# Altium schematic sheet Power ATX.SchDoc
size A3; SheetNumber: 2; SheetTotal: 16
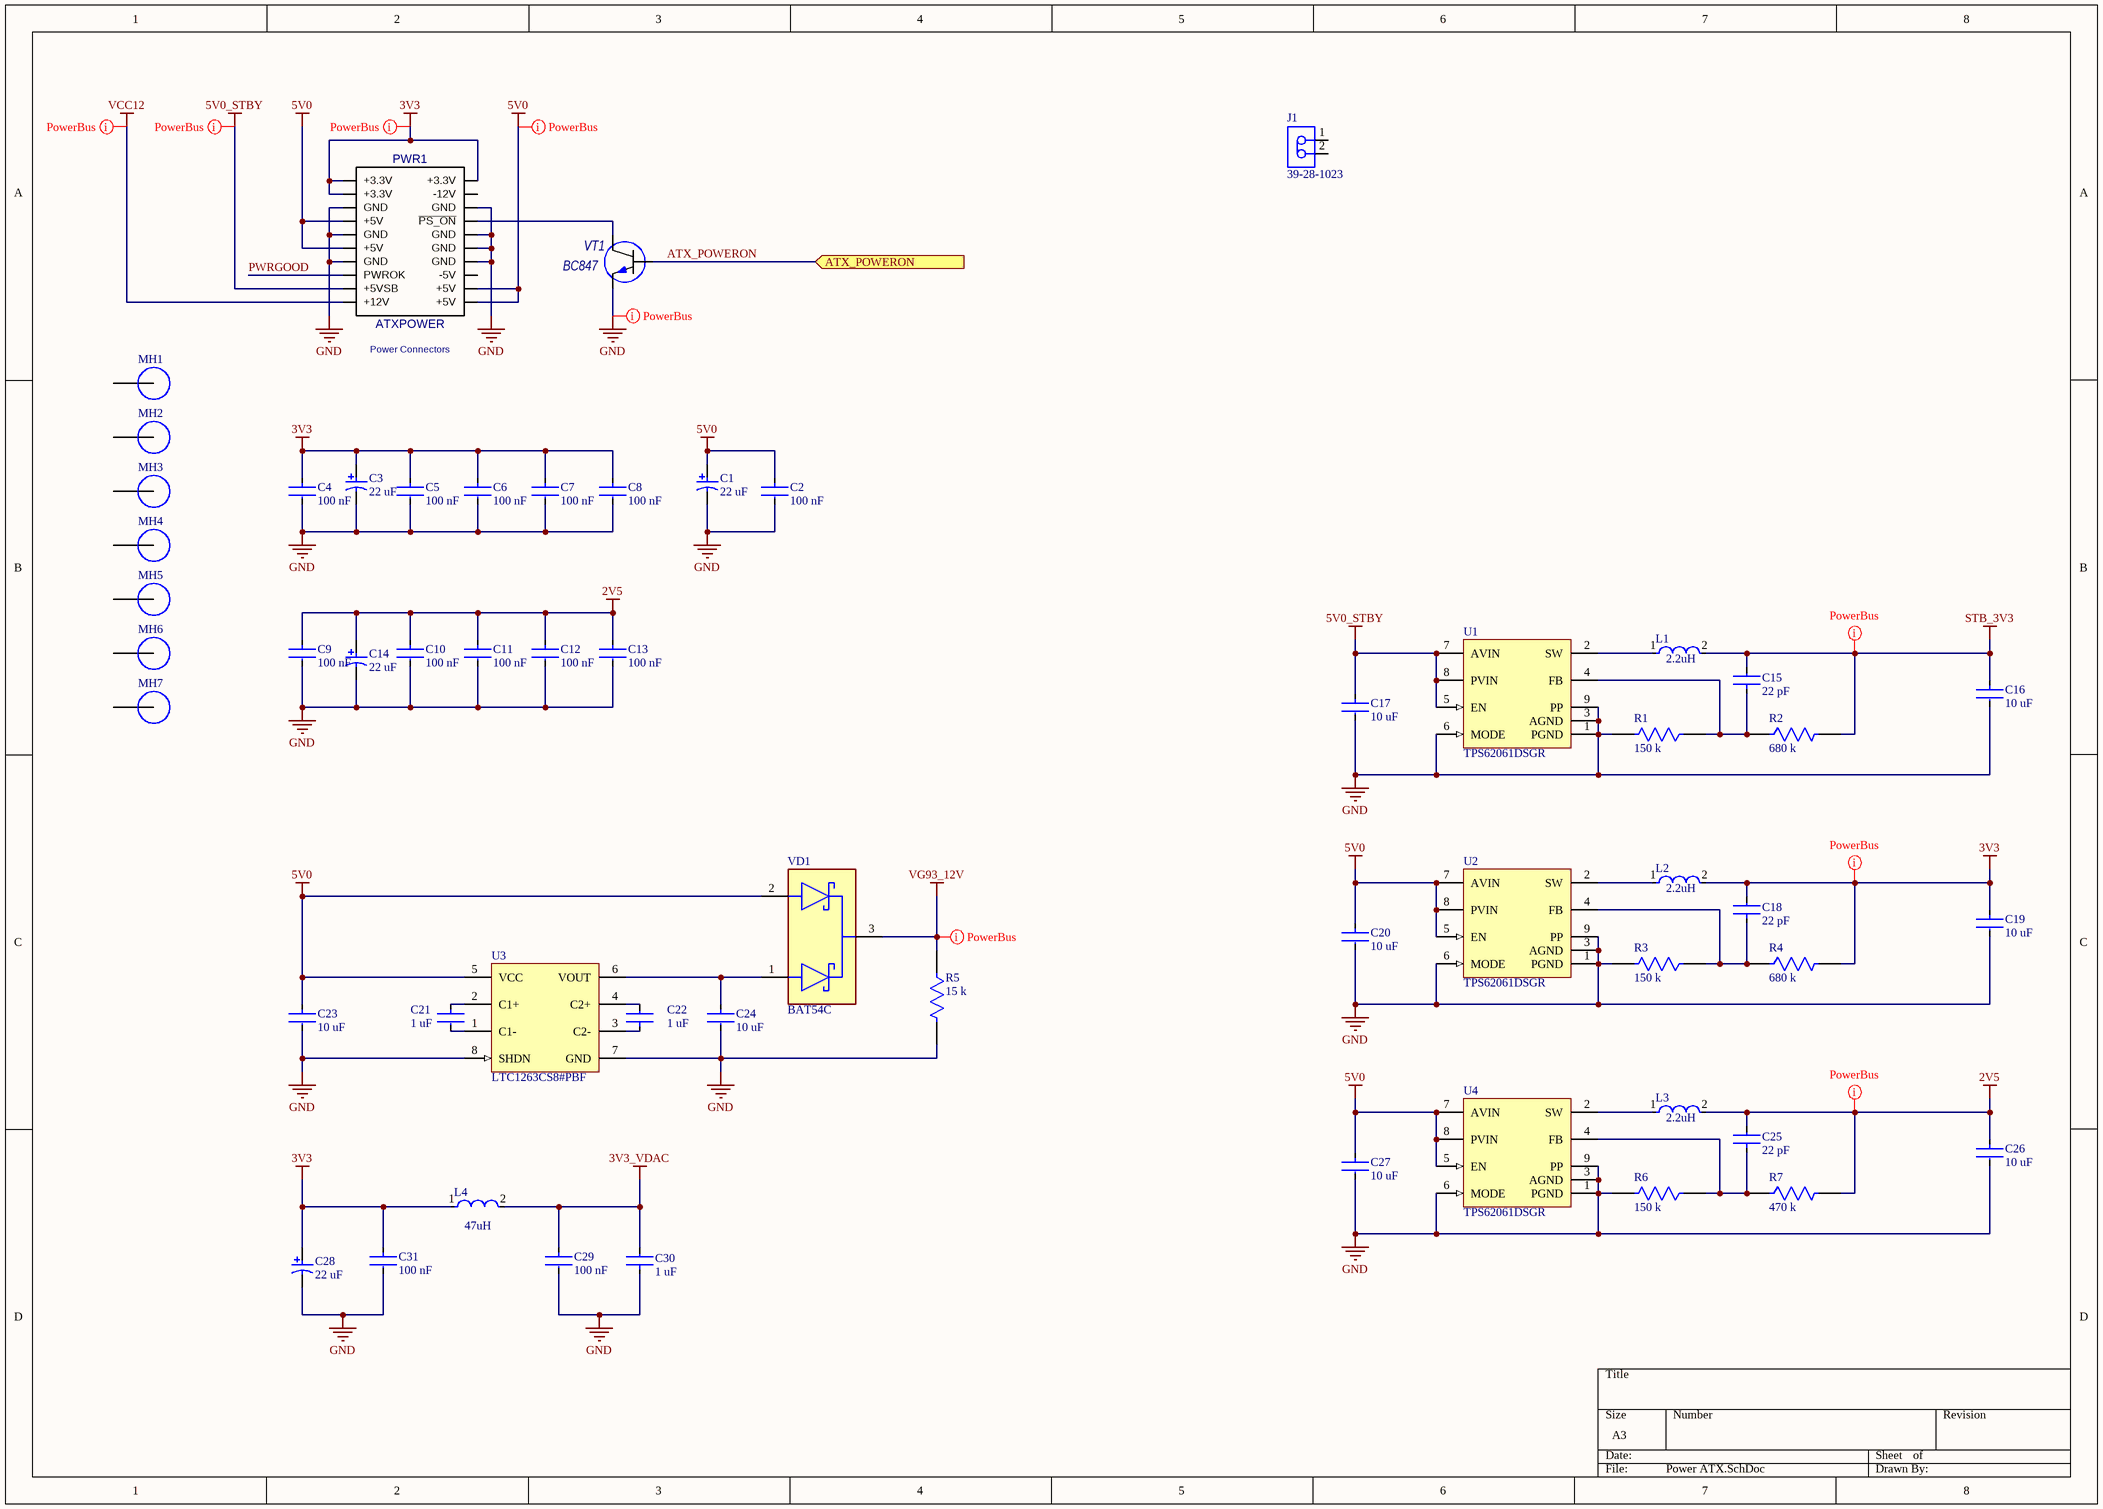
[diagram p0: Power ATX.SchDoc]

## Parts
C1  Capacitance: 22 uF  [AVX-TAJ-B-2_M]  (hidden comment: EC1210-22uF)
C2  Capacitance: 100 nF  [CC0805]  (hidden comment: CC0805-1.5pF)
C3  Capacitance: 22 uF  [AVX-TAJ-B-2_M]  (hidden comment: EC1210-22uF)
C4  Capacitance: 100 nF  [CC0805]  (hidden comment: CC0805-1.5pF)
C5  Capacitance: 100 nF  [CC0805]  (hidden comment: CC0805-1.5pF)
C6  Capacitance: 100 nF  [CC0805]  (hidden comment: CC0805-1.5pF)
C7  Capacitance: 100 nF  [CC0805]  (hidden comment: CC0805-1.5pF)
C8  Capacitance: 100 nF  [CC0805]  (hidden comment: CC0805-1.5pF)
C9  Capacitance: 100 nF  [CC0805]  (hidden comment: CC0805-1.5pF)
C10  Capacitance: 100 nF  [CC0805]  (hidden comment: CC0805-1.5pF)
C11  Capacitance: 100 nF  [CC0805]  (hidden comment: CC0805-1.5pF)
C12  Capacitance: 100 nF  [CC0805]  (hidden comment: CC0805-1.5pF)
C13  Capacitance: 100 nF  [CC0805]  (hidden comment: CC0805-1.5pF)
C14  Capacitance: 22 uF  [AVX-TAJ-B-2_M]  (hidden comment: EC1210-22uF)
C15  Capacitance: 22 pF  [CC0805]  (hidden comment: CC0805-1.5pF)
C16  Capacitance: 10 uF  [CC0805]  (hidden comment: CC0805-1.5pF)
C17  Capacitance: 10 uF  [CC0805]  (hidden comment: CC0805-1.5pF)
C18  Capacitance: 22 pF  [CC0805]  (hidden comment: CC0805-1.5pF)
C19  Capacitance: 10 uF  [CC0805]  (hidden comment: CC0805-1.5pF)
C20  Capacitance: 10 uF  [CC0805]  (hidden comment: CC0805-1.5pF)
C21  Capacitance: 1 uF  [CC0805]  (hidden comment: CC0805-1.5pF)
C22  Capacitance: 1 uF  [CC0805]  (hidden comment: CC0805-1.5pF)
C23  Capacitance: 10 uF  [CC0805]  (hidden comment: CC0805-1.5pF)
C24  Capacitance: 10 uF  [CC0805]  (hidden comment: CC0805-1.5pF)
C25  Capacitance: 22 pF  [CC0805]  (hidden comment: CC0805-1.5pF)
C26  Capacitance: 10 uF  [CC0805]  (hidden comment: CC0805-1.5pF)
C27  Capacitance: 10 uF  [CC0805]  (hidden comment: CC0805-1.5pF)
C28  Capacitance: 22 uF  [AVX-TAJ-B-2_M]  (hidden comment: EC1210-22uF)
C29  Capacitance: 100 nF  [CC0805]  (hidden comment: CC0805-1.5pF)
C30  Capacitance: 1 uF  [CC0805]  (hidden comment: CC0805-1.5pF)
C31  Capacitance: 100 nF  [CC0805]  (hidden comment: CC0805-1.5pF)
J1  39-28-1023  [MOLX-39-28-1023-2_V]
L1  Inductance: 2.2uH  [FP-NR6028-MFG]  (hidden comment: NR6028T2R2N)
L2  Inductance: 2.2uH  [FP-NR6028-MFG]  (hidden comment: NR6028T2R2N)
L3  Inductance: 2.2uH  [FP-NR6028-MFG]  (hidden comment: NR6028T2R2N)
L4  Inductance: 47uH  [FP-NR6028-MFG]  (hidden comment: NR6028T470M)
MH1  MOUNT HOLE  [MOUNT HOLE]  (value not drawn)
MH2  MOUNT HOLE  [MOUNT HOLE]  (value not drawn)
MH3  MOUNT HOLE  [MOUNT HOLE]  (value not drawn)
MH4  MOUNT HOLE  [MOUNT HOLE]  (value not drawn)
MH5  MOUNT HOLE  [MOUNT HOLE]  (value not drawn)
MH6  MOUNT HOLE  [MOUNT HOLE]  (value not drawn)
MH7  MOUNT HOLE  [MOUNT HOLE]  (value not drawn)
PWR1  ATXPOWER  [ATXPOWER]
R1  Resistance: 150 k  [CR0805]  (hidden comment: CR0805-51)
R2  Resistance: 680 k  [CR0805]  (hidden comment: CR0805-51)
R3  Resistance: 150 k  [CR0805]  (hidden comment: CR0805-51)
R4  Resistance: 680 k  [CR0805]  (hidden comment: CR0805-51)
R5  Resistance: 15 k  [CR0805]  (hidden comment: CR0805-51)
R6  Resistance: 150 k  [CR0805]  (hidden comment: CR0805-51)
R7  Resistance: 470 k  [CR0805]  (hidden comment: CR0805-51)
U1  TPS62061DSGR  [DSG0008A_V]
U2  TPS62061DSGR  [DSG0008A_V]
U3  LTC1263CS8#PBF  [LT-S8-8_N]
U4  TPS62061DSGR  [DSG0008A_V]
VD1  BAT54C  [SOT-23]
VT1  BC847  [SOT-23]

## Ports
ATX_POWERON (in)

## Nets
2V5: C9.1 C10.1 C11.1 C12.1 C13.1 C14.1 C25.2 C26.1 L3.2 R7.2
3V3: C3.1 C4.1 C5.1 C6.1 C7.1 C8.1 C18.2 C19.1 C28.1 C31.1 L2.2 L4.1 PWR1.1(+3.3V) PWR1.2(+3.3V) PWR1.11(+3.3V) R4.2
3V3_VDAC: C29.1 C30.2 L4.2
5V0: C1.1 C2.1 C20.1 C23.1 C27.1 PWR1.4(+5V) PWR1.6(+5V) PWR1.19(+5V) PWR1.20(+5V) U2.5(EN) U2.7(AVIN) U2.8(PVIN) U3.5(VCC) U4.5(EN) U4.7(AVIN) U4.8(PVIN) VD1.2(2_ANODE)
5V0_STBY: C17.1 PWR1.9(+5VSB) U1.5(EN) U1.7(AVIN) U1.8(PVIN)
GND: C1.2 C2.2 C3.2 C4.2 C5.2 C6.2 C7.2 C8.2 C9.2 C10.2 C11.2 C12.2 C13.2 C14.2 C16.2 C17.2 C19.2 C20.2 C23.2 C24.2 C26.2 C27.2 C28.2 C29.2 C30.1 C31.2 PWR1.3(GND) PWR1.5(GND) PWR1.7(GND) PWR1.13(GND) PWR1.15(GND) PWR1.16(GND) PWR1.17(GND) R1.2 R3.2 R5.2 R6.2 U1.1(PGND) U1.3(AGND) U1.6(MODE) U1.9(PP) U2.1(PGND) U2.3(AGND) U2.6(MODE) U2.9(PP) U3.7(GND) U3.8(SHDN) U4.1(PGND) U4.3(AGND) U4.6(MODE) U4.9(PP) VT1.2(emitter)
STB_3V3: C15.2 C16.1 L1.2 R2.2
VCC12: PWR1.10(+12V)
VG93_12V: R5.1 VD1.3(COMMON_CATHODE)
ATX_POWERON: VT1.1(base) ; port ATX_POWERON
PWRGOOD: PWR1.8(PWROK)
NetC15_1: C15.1 R1.1 R2.1 U1.4(FB)
NetC18_1: C18.1 R3.1 R4.1 U2.4(FB)
NetC21_1: C21.1 U3.2(C1+)
NetC21_2: C21.2 U3.1(C1-)
NetC22_1: C22.1 U3.3(C2-)
NetC22_2: C22.2 U3.4(C2+)
NetC24_1: C24.1 U3.6(VOUT) VD1.1(1_ANODE)
NetC25_1: C25.1 R6.1 R7.1 U4.4(FB)
NetL1_1: L1.1 U1.2(SW)
NetL2_1: L2.1 U2.2(SW)
NetL3_1: L3.1 U4.2(SW)
NetPWR1_14: PWR1.14(~{PS_ON}) VT1.3(collector)

Not connected (* = marked no-connect by the designer): J1 1 2; MH1 0(55); MH2 0(55); MH3 0(55); MH4 0(55); MH5 0(55); MH6 0(55); MH7 0(55); PWR1 12(-12V) 18(-5V)

## Layout directives
net class PowerBus: 2V5, 3V3, 5V0, 5V0_STBY, GND, STB_3V3, VCC12, VG93_12V

## Notes on the sheet
- (near PWR1) Power Connectors

## Library data of the parts
C1 C3 C14 C28 = EC1210-22uF: Standard Tantalum, 22 uF, +/- 10%, 16 V, -55 to 125 degC, 2-Pin SMD (1210), RoHS, Tape and Reel; Manufacturer: Kyocera AVX; Manufacturer Part Number: TAJB226K016RNJ; value: 22uF; Number of Pins: 2; Termination: SMD/SMT; Case/Package: 1210; Category: Cap
C2 C4-C13 C15-C20 C23-C27 C29 C31 = CC0805: CL21 Series 0805 1.5pF 50V ±0.25pF Tolerance C0G Multilayer Ceramic Chip Capacitor; Manufacturer Part Number: CL21C1R5CBANNNC; Manufacturer: Samsung; value: 1.5pF; Category: Cap; Case/Package: 0805
C21 C22 C30 = CC0805: CL21 Series 0805 1.5pF 50V ±0.25pF Tolerance C0G Multilayer Ceramic Chip Capacitor; Manufacturer: Samsung; Manufacturer Part Number: CL21C1R5CBANNNC; Case/Package: 0805; value: 1.5pF; Category: Cap
J1 = CMP-2000-05244-1: Female Header, Pitch 4.2 mm, 1 x 2 Position, Height 12.8 mm, Tail Length 3.5 mm, -40 to 105 degC, RoHS; Manufacturer: Molex; No. of Poles: 2; Working Voltage: 250V; No. of Rows: 1; Current Rating: 13A; Contact Termination: Solder; No. of Contacts: 4; Connector Body Material: –; Voltage Rating V AC: 600V; Mounting Orientation: Straight; Pitch Spacing: 4.2mm; Connector Mounting: PCB; Connector Type: RectangularPower; Manufacturer URL: http://www.molex.com/; Contact Plating: Tin; Gender: Header; Lead Spacing: 4.2mm; Colour: Clear; Series: Mini-FitJr; No. of Ways: 2; MSL: –; Connector Insert Type: Header; Flammability Rating: UL94V-2; Datasheet URL: https://datasheet.ciiva.com/11746/0900766b80460d9e-11746456.pdf; Termination Method: Solder; Mounting Type: PCBoard; Contact Material: Brass; Datasheet Version: Rev. F, 05/2004; SVHC: –; Connector Mounting Orientation: PCB; Contact Gender: –
L1-L3 = CMP-14484-000415-1: SMD Power Inductors 2.2uH ±30% 3.7A 26mΩ; Core Material: Ferrite; Test Frequency: 100kHz; DC Resistance (DCR): 26mR; Saturation Current: 4.2A; Self Resonant Frequency: 68MHz; Shielding: Shielded; Width: 0.236inch; Package Quantity: 2000; Case/Package: 2424; Length: 0.236inch; Height: 2.8mm; Height - Seated (Max): 0.11inch; RMS Current (Irms): 3.7A; Current Rating: 3.7A; Termination: SMD/SMT; Tolerance: 30%; Inductance Tolerance: 30%; Depth: 6.2mm; Halogen Free: Halogen Free; Mount: Surface Mount; Series: NR; Max DC Current: 3.7A; Number of Pins: 2; Min Operating Temperature: -25°C; Max Operating Temperature: 120°C; Packaging: Tape and Reel; Radiation Hardening: No; RoHS Compliant: Yes; Resistor Type: Wirewound
L4 = CMP-14484-001222-1: SMD Power Inductors 47uH ±20% 0.92A 0.39Ω; Current Rating: 920mA; Test Frequency: 100kHz; Core Material: Ferrite; Self Resonant Frequency: 8MHz; Shielding: Shielded; DC Resistance (DCR): 390mR; Saturation Current: 950mA; Termination: SMD/SMT; Package Quantity: 2000; RoHS Compliant: Yes; Halogen Free: Halogen Free; Length: 0.236inch; Series: NR; Tolerance: 20%; Width: 0.236inch; Height - Seated (Max): 0.11inch; Number of Pins: 2; Mount: Surface Mount; Min Operating Temperature: -25°C; RMS Current (Irms): 920mA; Packaging: Tape and Reel; Resistor Type: Wirewound; Case/Package: 2424; Inductance Tolerance: 20%; Max Operating Temperature: 120°C; Max DC Current: 920mA; Height: 2.8mm
PWR1 = ATXPOWER: Analogs: MF-20MA;N42GP-20; Value: ATXPOWER; Case/Package: Mini-Fit 20 PIN 5.2; Category: Connector
R1-R7 = CR0805: 51Ω ±0.5% 0.1W 1/10W Chip Resistor 0805 (2012 Metric) Thin Film; Manufacturer Part Number: RR1220Q-510-D; Manufacturer: Susumu; Category: Res; value: 51Ω; Case/Package: 0805; Number of Terminations: 2; Termination: SMD/SMT; Number of Pins: 2
U1 U2 U4 = CMP-0323-00325-3: Buck Step Down Regulator with 2.7 to 6 V Input and 1.8 V Output, -40 to 85 degC, 8-Pin WSON (DSG), Green (RoHS & no Sb/Br); Manufacturer: Texas Instruments; SubFamily: Step-Down Regulator; Vin(Max)(V): 6; Preset Vout(V): 1.8; Synchronous Rectification: TRUE; Iout(Max)(A): 1.6; Switch Current Limit(Typ)(A): 2.25; Iq(Typ)(mA): 0.018; Regulated Outputs(#): 1; Duty Cycle(Max)(%): 100; Rating: Catalog; Vin(Min)(V): 2.7; ComponentLink2Description: Package Specification; PartNumber: TPS62061DSGR; ComponentLink2URL: http://www.ti.com/litv/pdf/mpds308a; ComponentLink1Description: Datasheet; PackageDescription: 8-Pin Plastic Small Outline No-Lead, 2 x 2 x 0.8 mm Body, 0.5 mm Pitch, Exposed Pad; Code_JEDEC: MO-229; Mounting Technology: Surface Mount; Vout(Min)(V): 1.8; DatasheetVersion: SLVSA95A; ComponentLink3Description: URL Link1; ComponentLink1URL: http://www.ti.com/general/docs/lit/getliterature.tsp?genericPartNumber=TPS62061&fileType=pdf; PackageReference: DSG0008A; ComponentLink3URL: Samples URL:http://www.ti.com/product/tps62061#samples; PackageVersion: revB, Oct-2010; Topology: Buck; Vout(Max)(V): 1.8; Eco-Plan: Green (RoHS & no Sb/Br)
U3 = CMP-0475-00531-1: 60 mA Flash Memory Programming Supply, 4.75 to 5.5 V Vin, 12 V Vout, 8-pin SOIC (S8-8), 0 to 70 degC, Pb-Free; Manufacturer: Linear Technology; Isupply(mA): 0.3; Vin Min(V): 4.75; Vin Max(V): 5.5; Max Iout(mA): 60; Ishutdown(uA): 0.5; Voutput: 12V; Frequency(kHz): 300; ComponentLink3Description: Package Specification; ComponentLink1Description: Manufacturer URL; ComponentLink2URL: http://cds.linear.com/docs/en/datasheet/1263f.pdf; ComponentLink3URL: http://cds.linear.com/docs/en/packaging/05081610_G_SO8.pdf; PartNumber: LTC1263CS8#PBF; ComponentLink2Description: Datasheet; ComponentLink1URL: http://www.linear.com/; PackageVersion: Rev. G, 03/2012; RoHS: TRUE; PackageReference: S8-8; Mounting Technology: Surface Mount; PackageDescription: 8-Pin Plastic Small Outline (Narrow .150 Inch), Body 4.9 x 3.9 mm, Pitch 1.27 mm
VD1 = BAT54C: DIODE ARRAY SCHOTTKY 30V SOT23-3; Manufacturer: ON Semiconductor / Fairchild; Capacitance: 10pF; Category: Diode; Manufacturer Part Number: BAT54C; Value: BAT54C; Case/Package: SOT-23
VT1 = BC847: Value: BC847; Case/Package: SOT-23; Category: Transistor